# EAGLE schematic D0-Shield (EAGLE 9.6.2)
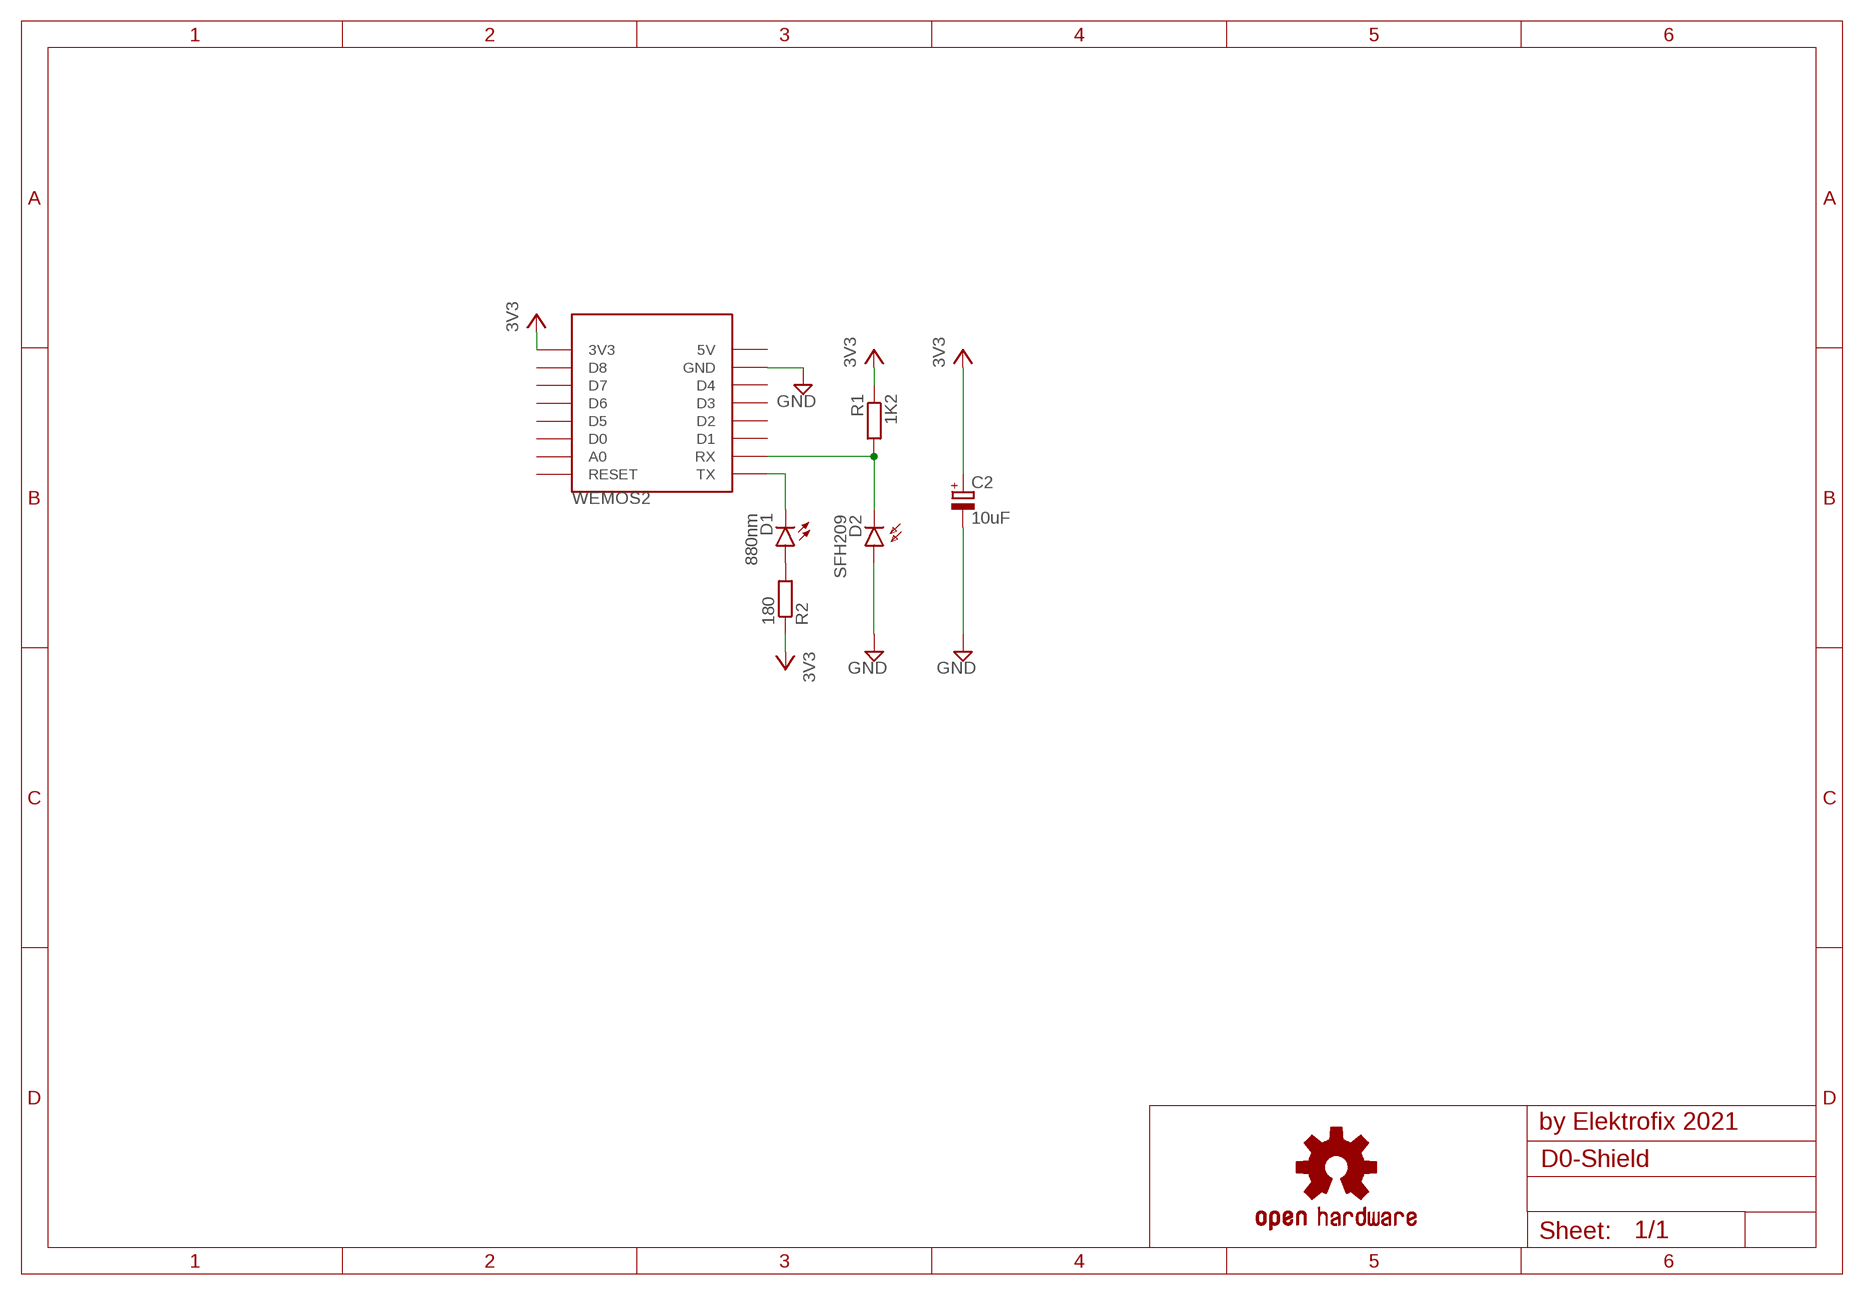
[diagram p0: schematic, sheet 1]

## Parts
C2  10uF  CPOL-EUE3.5-8  [E3,5-8]
D1  880nm  SFH482  [SFH482]
D2  SFH209  SFH205  [SFH205]
LOGO1  OSHW-LOGOL  [OSHW-LOGO-L]
R1  1K2  R-EU_0207/12  [0207/12]
R2  180  R-EU_0207/12  [0207/12]
WEMOS2  WEMOS-D1-MINI  [WEMOS-D1-MINI]

## Nets
3V3: R1.1 R2.1 WEMOS2.3V3
GND: C2.- D2.A WEMOS2.GND
N$1: D1.A R2.2
N$2: D1.K(C) WEMOS2.TX
N$3: D2.K(C) R1.2 WEMOS2.RX
VCC: C2.+ ; supply symbol labelled 3V3
Unconnected: WEMOS2.5V WEMOS2.A0 WEMOS2.D0 WEMOS2.D1 WEMOS2.D2 WEMOS2.D3 WEMOS2.D4 WEMOS2.D5 WEMOS2.D6 WEMOS2.D7 WEMOS2.D8 WEMOS2.RESET

## Notes on the sheet
- by Elektrofix 2021

## Library data of the parts
C2 = rcl:CPOL-EU: POLARIZED CAPACITOR, European symbol; SPICEPREFIX: C
D1 = led:SFH482: IR LED infrared emitting diode, Infineon
D2 = opto-trans-siemens:SFH205: PHOTO DIODE; OC_FARNELL: unknown; OC_NEWARK: unknown
LOGO1 = SparkFun-Aesthetics:OSHW-LOGO: Open-Source Hardware (OSHW) Logo This logo indicates the piece of hardware it is found on incorporates a OSHW license and/or adheres to the definition of open source hardware found here: http://freedomdefined.org/OSHW
R1 R2 = resistor:R-EU_: RESISTOR, European symbol
WEMOS2 = esp8266modules:WEMOS-D1-MINI: WeMos.cc D1 mini ESP8266 module